# EAGLE design A-star_dual_dc_motor2a (EAGLE 7.1.0)
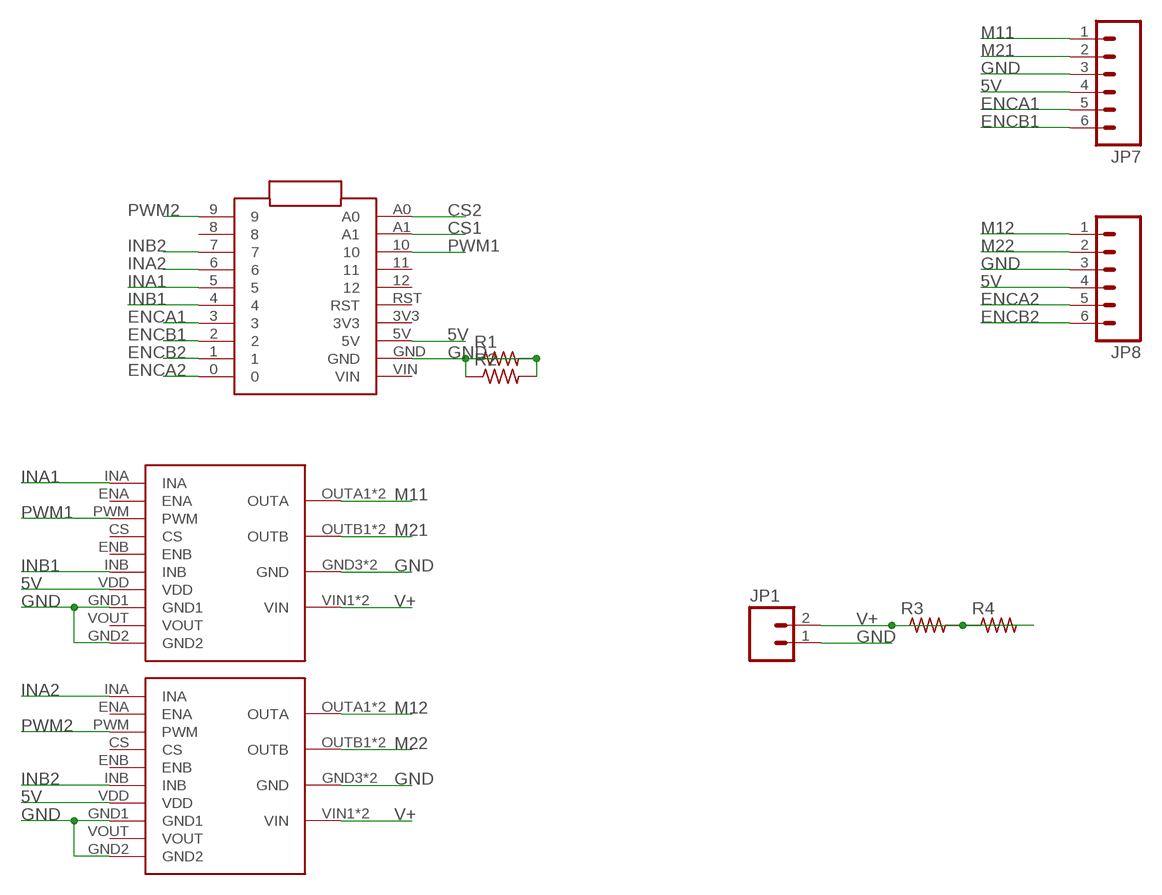
[diagram p0: schematic, sheet 1]

## Parts
ALL_PADS1  POLOLU_VNH5019_CARRIER  [VNH5019_CARRIER]
ALL_PADS2  POLOLU_VNH5019_CARRIER  [VNH5019_CARRIER]
JP1  M023.5MM  [SCREWTERMINAL-3.5MM-2]
JP7  M06SIP  [1X06]
JP8  M06SIP  [1X06]
R1  RES-US1206FAB  [R1206FAB]
R2  RES-US1206FAB  [R1206FAB]
R3  RES-US1206FAB  [R1206FAB]
R4  RES-US1206FAB  [R1206FAB]
U$1  POLOLU_A-STAR-MICRO  [POLOLU_A-STAR-MICRO]

## Nets
5V: ALL_PADS1.VDD ALL_PADS2.VDD JP7.4 JP8.4 U$1.5V
CS1: U$1.A1
CS2: U$1.A0
ENCA1: JP7.5 U$1.3
ENCA2: JP8.5 U$1.0
ENCB1: JP7.6 U$1.2
ENCB2: JP8.6 U$1.1
GND: ALL_PADS1.GND1 ALL_PADS1.GND2 ALL_PADS1.GND3(GND) ALL_PADS1.GND4(GND) ALL_PADS2.GND1 ALL_PADS2.GND2 ALL_PADS2.GND3(GND) ALL_PADS2.GND4(GND) JP1.1 JP7.3 JP8.3 R1.1 R1.2 R2.1 R2.2 U$1.GND
INA1: ALL_PADS1.INA U$1.5
INA2: ALL_PADS2.INA U$1.6
INB1: ALL_PADS1.INB U$1.4
INB2: ALL_PADS2.INB U$1.7
M11: ALL_PADS1.OUTA1(OUTA) ALL_PADS1.OUTA2(OUTA) JP7.1
M12: ALL_PADS2.OUTA1(OUTA) ALL_PADS2.OUTA2(OUTA) JP8.1
M21: ALL_PADS1.OUTB1(OUTB) ALL_PADS1.OUTB2(OUTB) JP7.2
M22: ALL_PADS2.OUTB1(OUTB) ALL_PADS2.OUTB2(OUTB) JP8.2
PWM1: ALL_PADS1.PWM U$1.10
PWM2: ALL_PADS2.PWM U$1.9
V+: ALL_PADS1.VIN1(VIN) ALL_PADS1.VIN2(VIN) ALL_PADS2.VIN1(VIN) ALL_PADS2.VIN2(VIN) JP1.2 R3.1 R3.2 R4.1 R4.2
Unconnected: ALL_PADS1.CS ALL_PADS1.ENA ALL_PADS1.ENB ALL_PADS1.VOUT ALL_PADS2.CS ALL_PADS2.ENA ALL_PADS2.ENB ALL_PADS2.VOUT U$1.3V3 U$1.8 U$1.11 U$1.12 U$1.RST U$1.VIN

## Library data of the parts
ALL_PADS1 ALL_PADS2 = will:POLOLU_VNH5019_CARRIER
JP1 = SparkFun:M02: Header 2 Standard 2-pin 0.1" header. Use with straight break away headers (SKU : PRT-00116), right angle break away headers (PRT-00553), swiss pins (PRT-00743), machine pins (PRT-00117), and female headers (PRT-00115). Molex polarized connector foot print use with SKU : PRT-08233 with associated crimp pins and housings.
JP7 JP8 = SparkFun:M06: Header 6 Standard 6-pin 0.1" header. Use with straight break away headers (SKU : PRT-00116), right angle break away headers (PRT-00553), swiss pins (PRT-00743), machine pins (PRT-00117), and female headers (PRT-00115). Molex polarized connector foot print use with SKU : PRT-08094 with associated crimp pins and housings. NOTES ON THE VARIANTS LOCK and LOCK_LONGPADS... This footprint was designed to help hold the alignment of a through-hole component (i.e. 6-pin header) while soldering it into place. You may notice that each hole has been shifted either up or down by 0.005 of an inch from it's more standard position (which is a perfectly straight line). This slight alteration caused the pins (the squares in the middle) to touch the edges of the holes. Because they are alternating, it causes a "brace" to hold the component in place. 0.005 has proven to be the perfect amount of "off-center" position when using our standard breakaway headers. Although looks a little odd when you look at the bare footprint, once you have a header in there, the alteration is very hard to notice. Also, if you push a header all the way into place, it is covered up entirely on the bottom side. This idea of altering the position of holes to aid alignment will be further integrated into the Sparkfun Library for other footprints. It can help hold any component with 3 or more connection pins.
R1-R4 = fab:RES-US: Resistor (US Symbol) Variants with postfix FAB are widened to allow the routing of internal traces
U$1 = will:POLOLU_A-STAR-MICRO

## Board
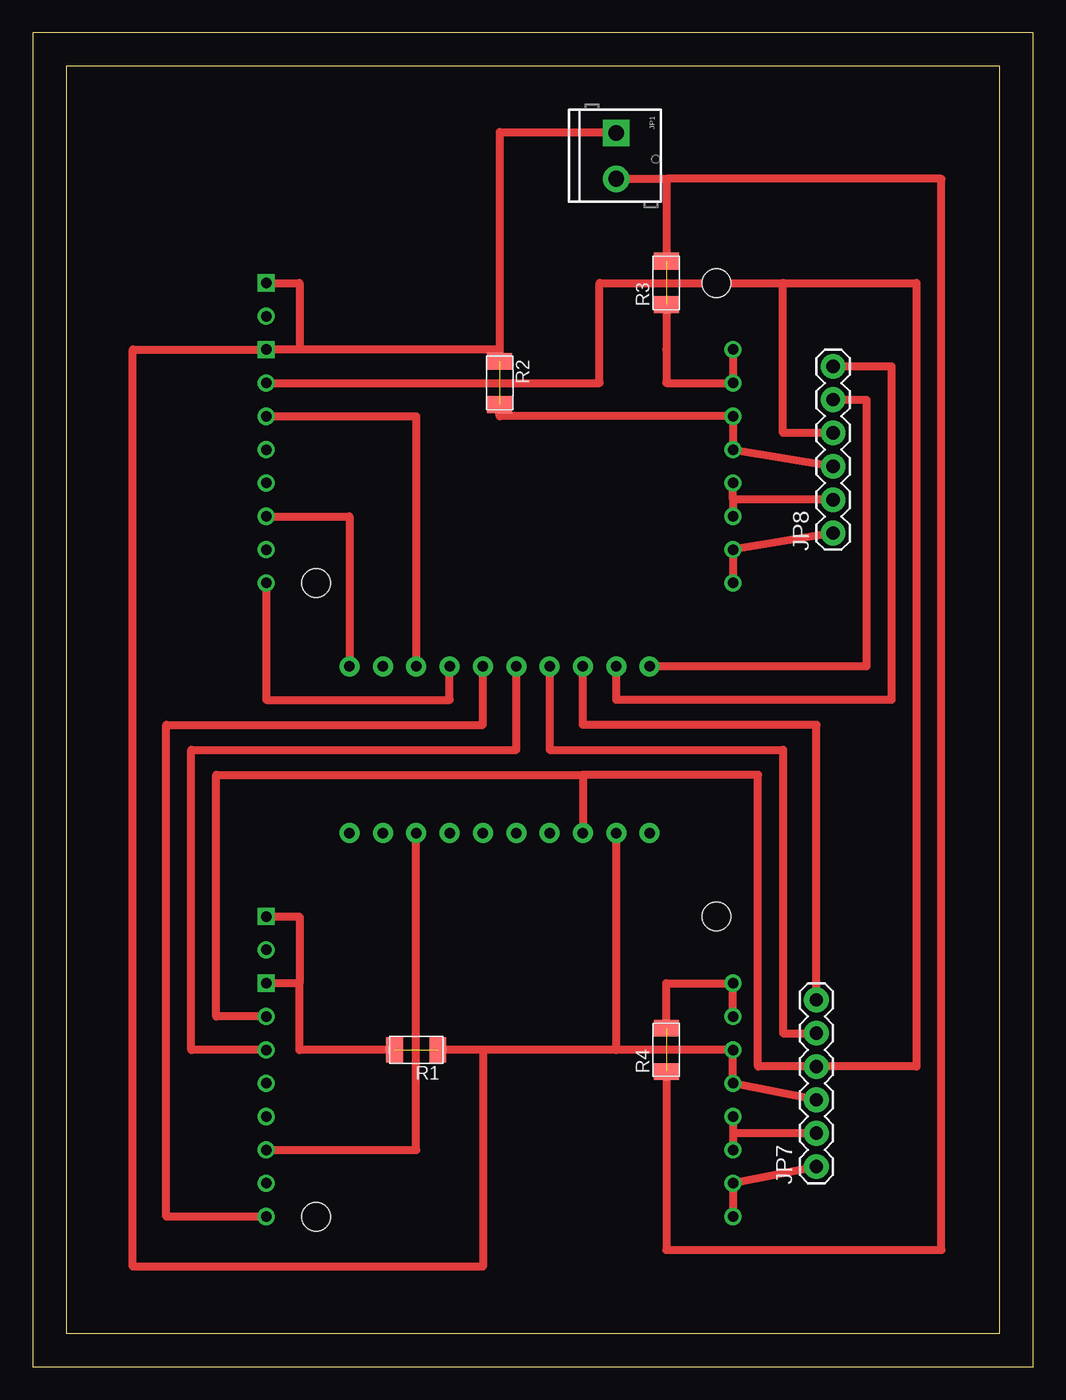
[diagram p1: board, top side]
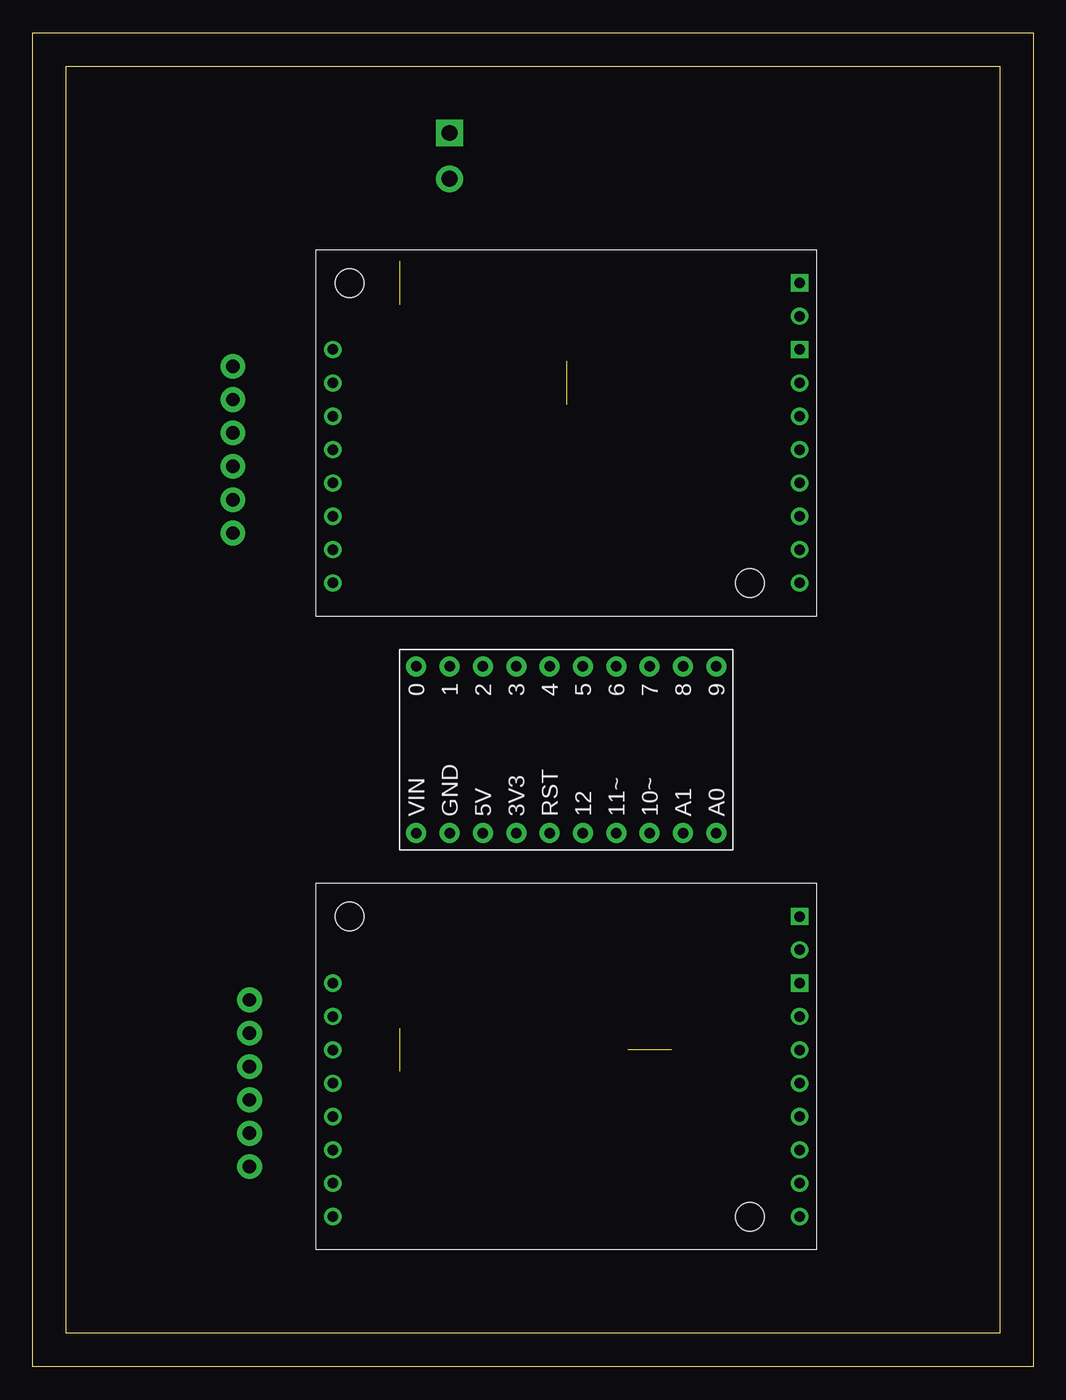
[diagram p2: board, bottom side, seen from below]

Size 76.2 x 101.6 mm. Coordinates in mm from the lower left corner, seen from the top.
Outline: 76.2,0 76.2,101.6 0,101.6 0,0 76.2,0
Copper layers (1*16): Top 0.035mm / dielectric 1.5mm / Bottom 0.035mm
Design rules "fab *": minimum track width 0.3mm, minimum drill 0.8mm, track to track 0.4mm, track to pad 0.4mm, pad to pad 0.4mm, via to via 0.4mm, smd to smd 0.4mm, copper to edge 40mil, drill to drill 16mil, minimum pad ring 10mil, minimum via ring 8mil, stop-mask expansion 4mil, vias tented up to drill 0mil, thermal gap 10mil
Milling: area 2.5,2.5 to 73.7,99.1

### Footprints (pad centres in the part's own frame; a part is rotated, then mirrored left to right if it is on the bottom)
VNH5019_CARRIER = drill 0.8: CS 1.27,17.78; ENA 1.27,22.86; ENB 1.27,15.24; GND3 36.83,15.24; GND4 36.83,12.7; INA 1.27,25.4; INB 1.27,12.7; OUTA1 36.83,25.4; OUTA2 36.83,22.86; OUTB1 36.83,20.32; OUTB2 36.83,17.78; PWM 1.27,20.32; VDD 1.27,10.16; VIN1 36.83,10.16; VIN2 36.83,7.62; VOUT 1.27,5.08 | drill 0.8 square: GND1 1.27,7.62; GND2 1.27,2.54 | hole 2.184: 5.08,25.4; 35.56,2.54
SCREWTERMINAL-3.5MM-2 = drill 1.2 pad 2.032 square: 1 0,0 | drill 1.2 pad 2.032: 2 3.5,0
1X06 = drill 1.016 pad 1.88: 1 0,0; 2 2.54,0; 3 5.08,0; 4 7.62,0; 5 10.16,0; 6 12.7,0
R1206FAB = smd 1.27 x 1.905: 1 -1.651,0; 2 1.651,0
POLOLU_A-STAR-MICRO = drill 0.8 pad 1.524: 0 -6.35,-12.7; 1 -6.35,-10.16; 2 -6.35,-7.62; 3 -6.35,-5.08; 3V3 6.35,-5.08; 4 -6.35,-2.54; 5 -6.35,0; 5V 6.35,-7.62; 6 -6.35,2.54; 7 -6.35,5.08; 8 -6.35,7.62; 9 -6.35,10.16; 10 6.35,5.08; 11 6.35,2.54; 12 6.35,0; A0 6.35,10.16; A1 6.35,7.62; GND 6.35,-10.16; RST 6.35,-2.54; VIN 6.35,-12.7

### Placement (x,y rotation side)
ALL_PADS1  16.51,36.83 180 bottom
ALL_PADS2  16.51,85.09 180 bottom
JP1  44.45,93.98 270 top
JP7  59.69,15.24 90 top
JP8  60.96,63.5 90 top
R1  29.21,24.13 180 top
R2  35.56,74.93 270 top
R3  48.26,82.55 90 top
R4  48.26,24.13 90 top
U$1  34.29,46.99 270 bottom

### Tracks (layer width: path | path; a pad name or v marks a point on that pad's centre or on a via)
5V
  Top 0.61: ALL_PADS1.VDD 13.97,26.67 13.97,45.09 41.91,45.09 | 41.91,45.09 U$1.5V | JP8.4 57.15,71.12 57.15,82.55 | 57.15,82.55 67.31,82.55 67.31,22.86 JP7.4 55.24,22.86 55.24,45.09 41.91,45.09 | ALL_PADS2.VDD 43.18,74.93 43.18,82.55 57.15,82.55
ENCA1
  Top 0.61: U$1.3 39.37,46.99 57.15,46.99 57.15,25.4 JP7.5
ENCA2
  Top 0.61: JP8.5 63.5,73.66 63.5,53.34 U$1.0
ENCB1
  Top 0.61: JP7.6 59.69,48.9 41.91,48.9 U$1.2
ENCB2
  Top 0.61: JP8.6 65.41,76.2 65.41,50.8 44.45,50.8 U$1.1
GND  (2 unrouted)
  Top 0.61: JP8.3 ALL_PADS2.GND3 ALL_PADS2.GND4 35.56,72.39 R2.2 | JP7.3 ALL_PADS1.GND3 ALL_PADS1.GND4 44.45,24.13 | ALL_PADS2.GND2 20.32,82.55 20.32,77.47 | 20.32,77.47 ALL_PADS2.GND1 7.62,77.47 7.62,7.62 34.29,7.62 34.29,24.13 | 44.45,24.13 U$1.GND | ALL_PADS1.GND2 20.32,34.29 20.32,29.21 | 20.32,29.21 ALL_PADS1.GND1 | 44.45,24.13 34.29,24.13 | 34.29,24.13 R1.1 | R1.2 20.32,24.13 20.32,29.21 | 20.32,77.47 35.56,77.47 R2.1 35.56,94.03 44.45,94.03 JP1.1
INA1
  Top 0.61: ALL_PADS1.INA 10.16,11.43 10.16,48.9 34.29,48.9 U$1.5
INA2
  Top 0.61: ALL_PADS2.INA 17.78,50.8 31.75,50.8 U$1.6
INB1
  Top 0.61: ALL_PADS1.INB 12.06,24.13 12.06,46.99 36.83,46.99 U$1.4
INB2
  Top 0.61: ALL_PADS2.INB 29.21,72.39 U$1.7
M11
  Top 0.61: JP7.1 ALL_PADS1.OUTA2 ALL_PADS1.OUTA1
M12
  Top 0.61: JP8.1 ALL_PADS2.OUTA2 ALL_PADS2.OUTA1
M21
  Top 0.61: ALL_PADS1.OUTB2 53.34,17.78 | 53.34,17.78 ALL_PADS1.OUTB1 | JP7.2 53.34,17.78
M22
  Top 0.61: JP8.2 53.34,66.04 | 53.34,66.04 ALL_PADS2.OUTB2 | 53.34,66.04 ALL_PADS2.OUTB1
PWM1
  Top 0.61: ALL_PADS1.PWM 29.21,16.51 U$1.10
PWM2
  Top 0.61: ALL_PADS2.PWM 24.13,64.77 U$1.9
V+  (2 unrouted)
  Top 0.61: ALL_PADS1.VIN1 ALL_PADS1.VIN2 48.26,29.21 R4.2 | 53.21,77.47 ALL_PADS2.VIN2 ALL_PADS2.VIN1 48.26,74.93 R3.1 48.26,77.47 | JP1.2 48.26,90.48 | 48.26,90.48 R3.2 | R4.1 48.26,8.89 69.22,8.89 69.22,90.48 48.26,90.48